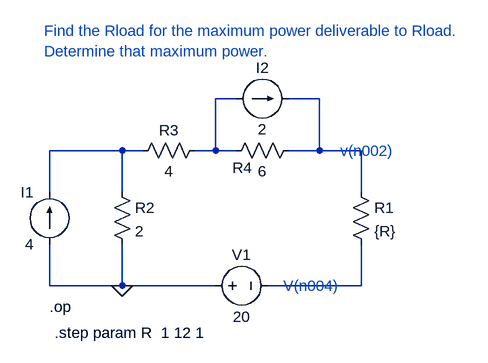
[diagram p0: schematic Lab3_ques4.asc]
Lab3_ques4.asc, the LTspice schematic file:
Version 4
SHEET 1 880 680
WIRE 288 -48 256 -48
WIRE 416 -48 368 -48
WIRE 112 32 0 32
WIRE 144 32 112 32
WIRE 256 32 256 -48
WIRE 256 32 224 32
WIRE 288 32 256 32
WIRE 416 32 416 -48
WIRE 416 32 368 32
WIRE 480 32 416 32
WIRE 0 96 0 32
WIRE 112 96 112 32
WIRE 480 96 480 32
WIRE 0 240 0 176
WIRE 112 240 112 176
WIRE 112 240 0 240
WIRE 256 240 112 240
WIRE 480 240 480 176
WIRE 480 240 336 240
FLAG 112 240 0
SYMBOL Voltage 240 240 R270
WINDOW 0 32 56 VTop 2
WINDOW 3 -32 56 VBottom 2
SYMATTR InstName V1
SYMATTR Value 20
SYMBOL Res 464 80 R0
SYMATTR InstName R1
SYMATTR Value {R}
SYMBOL Res 96 80 R0
SYMATTR InstName R2
SYMATTR Value 2
SYMBOL Res 240 16 R90
WINDOW 0 0 56 VBottom 2
WINDOW 3 32 56 VTop 2
SYMATTR InstName R3
SYMATTR Value 4
SYMBOL Res 384 16 R90
WINDOW 0 58 87 VBottom 2
WINDOW 3 32 56 VTop 2
SYMATTR InstName R4
SYMATTR Value 6
SYMBOL current 0 176 R180
WINDOW 0 24 80 Left 2
WINDOW 3 24 0 Left 2
SYMATTR InstName I1
SYMATTR Value 4
SYMBOL current 288 -48 R270
WINDOW 0 32 40 VTop 2
WINDOW 3 -32 40 VBottom 2
SYMATTR InstName I2
SYMATTR Value 2
TEXT 0 272 Left 2 !.op
TEXT 8 312 Left 2 !.step param R  1 12 1
TEXT -8 -152 Left 2 ;Find the Rload for the maximum power deliverable to Rload. \nDetermine that maximum power.
TEXT 448 32 Left 2 ;v(n002)
TEXT 360 240 Left 2 ;V(n004)

The netlist it stands for:
* Lab3_ques4.asc
V1 0 N004 20
R1 N002 N004 {R}
R2 N003 0 2
R3 N001 N003 4
R4 N002 N001 6
I1 0 N003 4
I2 N001 N002 2
.op
.step param R  1 12 1
* Find the Rload for the maximum power deliverable to Rload.
* Determine that maximum power.
* v(n002)
* V(n004)
.backanno
.end